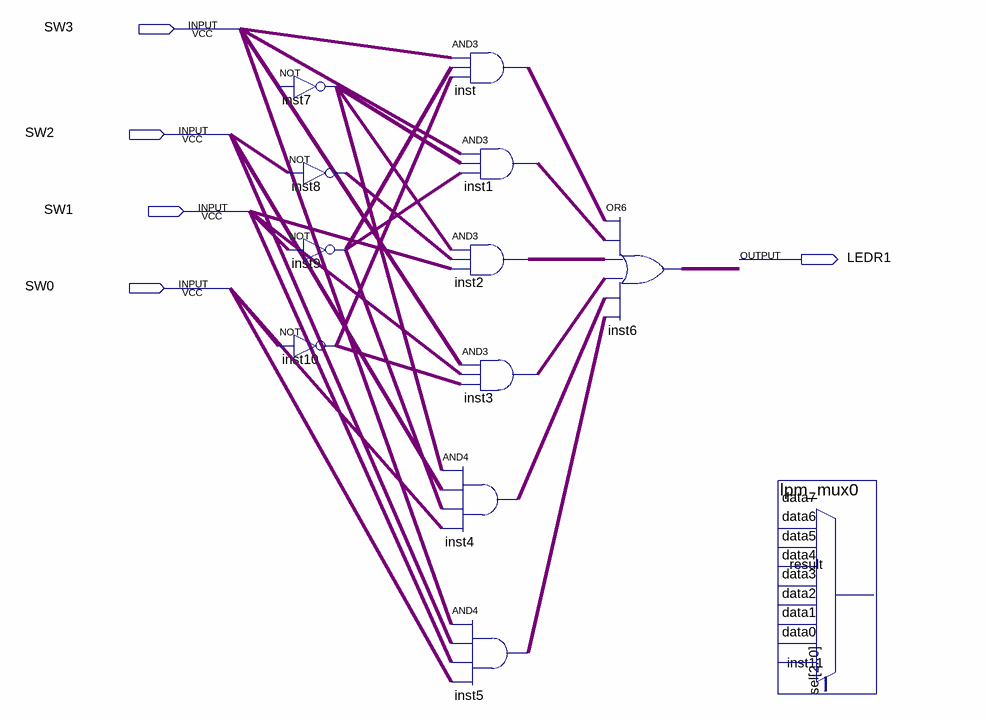
[diagram p0: schematic sheet]
// Quartus schematic Devoir1-2c1.bdf as structural Verilog: 12 symbols, 5 pins
module \Devoir1-2c1  (
  input  SW3,
  input  SW2,
  input  SW1,
  input  SW0,
  output LEDR1
);

  wire inst1_out, inst2_out, inst3_out, inst4_out, inst5_out, inst6_out, inst7_out, inst8_out, inst9_out,
       inst10_out, inst_out;

  not inst7 (inst7_out, SW3);
  not inst8 (inst8_out, SW2);
  not inst9 (inst9_out, SW1);
  not inst10 (inst10_out, SW0);
  and inst (inst_out, SW3, inst9_out, inst10_out);
  and inst1 (inst1_out, SW3, inst7_out, inst9_out);
  and inst2 (inst2_out, inst7_out, inst8_out, SW1);
  and inst3 (inst3_out, SW3, SW1, inst10_out);
  and inst4 (inst4_out, inst7_out, SW2, inst9_out, SW0);
  and inst5 (inst5_out, SW3, SW2, SW1, SW0);
  or inst6 (inst6_out, inst_out, inst1_out, inst2_out, inst3_out, inst4_out, inst5_out);
  lpm_mux0 inst11 ();  // open: data7, data6, data5, data4, data3, data2, data1, data0, sel, result
endmodule
